# Altium schematic sheet Supplies.SchDoc
size 127 x 254 mm
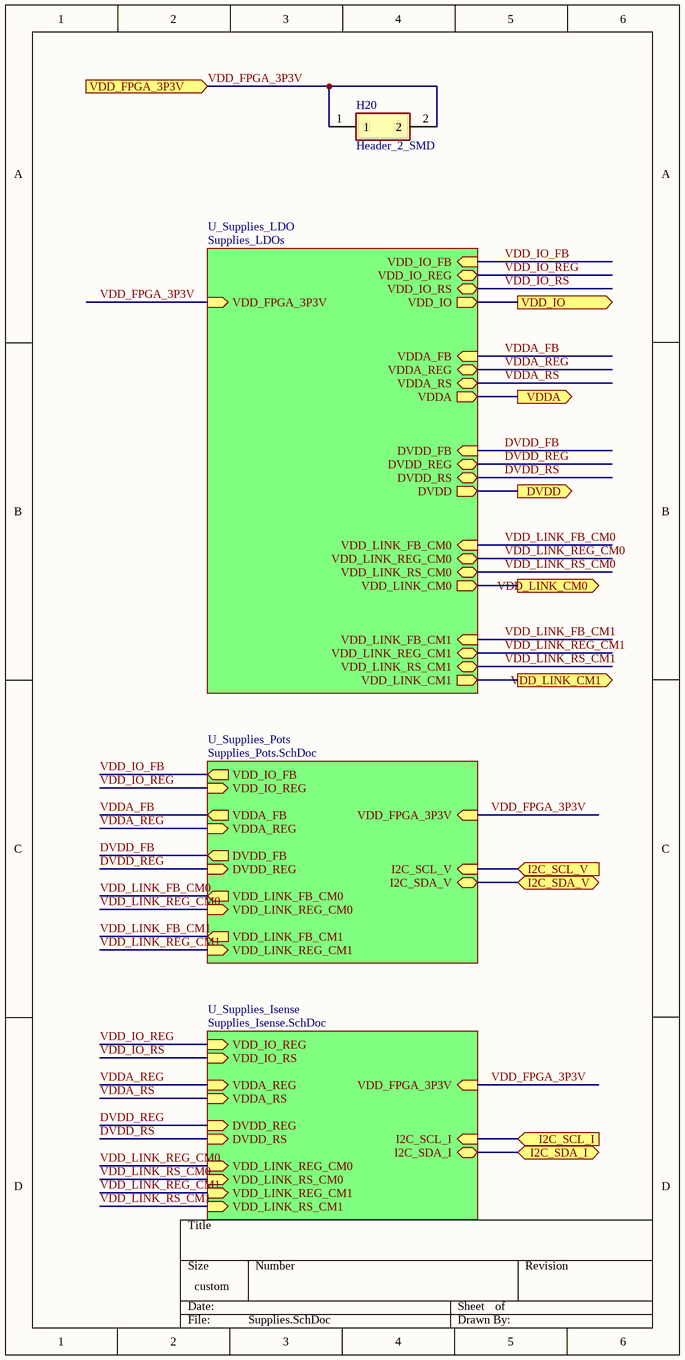
[diagram p0: Supplies.SchDoc]

## Parts
H20  Header_2_SMD  [HDR1X2_SMD_S]

## Sub-sheets
U_Supplies_Isense = Supplies_Isense.SchDoc: I2C_SDA_I (bidir), VDD_IO_REG (in), DVDD_REG (in), VDD_FPGA_3P3V (in), VDDA_RS (in), DVDD_RS (in), VDDA_REG (in), I2C_SCL_I (in), VDD_IO_RS (in), VDD_LINK_RS_CM1 (in), VDD_LINK_REG_CM1 (in), VDD_LINK_REG_CM0 (in), VDD_LINK_RS_CM0 (in)
U_Supplies_LDO = Supplies_LDOs: VDD_IO_FB (in), DVDD_FB (in), VDD_IO_RS (bidir), DVDD (out), VDDA_RS (bidir), VDDA (out), VDD_IO_REG (bidir), DVDD_RS (bidir), VDDA_FB (in), VDDA_REG (bidir), DVDD_REG (bidir), VDD_IO (out), VDD_FPGA_3P3V (in), VDD_LINK_RS_CM1 (bidir), VDD_LINK_FB_CM0 (in), VDD_LINK_CM1 (out), VDD_LINK_CM0 (out), VDD_LINK_REG_CM0 (bidir), VDD_LINK_REG_CM1 (bidir), VDD_LINK_FB_CM1 (in), VDD_LINK_RS_CM0 (bidir)
U_Supplies_Pots = Supplies_Pots.SchDoc: VDD_FPGA_3P3V (in), VDD_IO_REG (in), VDDA_FB (out), DVDD_REG (in), VDDA_REG (in), DVDD_FB (out), VDD_IO_FB (out), I2C_SCL_V (in), I2C_SDA_V (bidir), VDD_LINK_REG_CM1 (in), VDD_LINK_FB_CM0 (out), VDD_LINK_REG_CM0 (in), VDD_LINK_FB_CM1 (out)

## Ports
DVDD (out), I2C_SCL_I (in), I2C_SCL_V (in), I2C_SDA_I (bidir), I2C_SDA_V (bidir), VDD_FPGA_3P3V (in), VDD_IO (out), VDD_LINK_CM0 (out), VDD_LINK_CM1 (out), VDDA (out)

## Nets
DVDD: port DVDD, sheet U_Supplies_LDO/DVDD
DVDD_FB: sheet U_Supplies_LDO/DVDD_FB, sheet U_Supplies_Pots/DVDD_FB
DVDD_REG: sheet U_Supplies_LDO/DVDD_REG, sheet U_Supplies_Isense/DVDD_REG, sheet U_Supplies_Pots/DVDD_REG
DVDD_RS: sheet U_Supplies_LDO/DVDD_RS, sheet U_Supplies_Isense/DVDD_RS
I2C_SCL_I: port I2C_SCL_I, sheet U_Supplies_Isense/I2C_SCL_I
I2C_SCL_V: port I2C_SCL_V, sheet U_Supplies_Pots/I2C_SCL_V
I2C_SDA_I: port I2C_SDA_I, sheet U_Supplies_Isense/I2C_SDA_I
I2C_SDA_V: port I2C_SDA_V, sheet U_Supplies_Pots/I2C_SDA_V
VDD_FPGA_3P3V: H20.1 H20.2 ; port VDD_FPGA_3P3V, sheet U_Supplies_LDO/VDD_FPGA_3P3V, sheet U_Supplies_Isense/VDD_FPGA_3P3V, sheet U_Supplies_Pots/VDD_FPGA_3P3V
VDD_IO: port VDD_IO, sheet U_Supplies_LDO/VDD_IO
VDD_IO_FB: sheet U_Supplies_LDO/VDD_IO_FB, sheet U_Supplies_Pots/VDD_IO_FB
VDD_IO_REG: sheet U_Supplies_LDO/VDD_IO_REG, sheet U_Supplies_Isense/VDD_IO_REG, sheet U_Supplies_Pots/VDD_IO_REG
VDD_IO_RS: sheet U_Supplies_LDO/VDD_IO_RS, sheet U_Supplies_Isense/VDD_IO_RS
VDD_LINK_CM0: port VDD_LINK_CM0, sheet U_Supplies_LDO/VDD_LINK_CM0
VDD_LINK_CM1: port VDD_LINK_CM1, sheet U_Supplies_LDO/VDD_LINK_CM1
VDD_LINK_FB_CM0: sheet U_Supplies_LDO/VDD_LINK_FB_CM0, sheet U_Supplies_Pots/VDD_LINK_FB_CM0
VDD_LINK_FB_CM1: sheet U_Supplies_LDO/VDD_LINK_FB_CM1, sheet U_Supplies_Pots/VDD_LINK_FB_CM1
VDD_LINK_REG_CM0: sheet U_Supplies_LDO/VDD_LINK_REG_CM0, sheet U_Supplies_Isense/VDD_LINK_REG_CM0, sheet U_Supplies_Pots/VDD_LINK_REG_CM0
VDD_LINK_REG_CM1: sheet U_Supplies_LDO/VDD_LINK_REG_CM1, sheet U_Supplies_Isense/VDD_LINK_REG_CM1, sheet U_Supplies_Pots/VDD_LINK_REG_CM1
VDD_LINK_RS_CM0: sheet U_Supplies_LDO/VDD_LINK_RS_CM0, sheet U_Supplies_Isense/VDD_LINK_RS_CM0
VDD_LINK_RS_CM1: sheet U_Supplies_LDO/VDD_LINK_RS_CM1, sheet U_Supplies_Isense/VDD_LINK_RS_CM1
VDDA: port VDDA, sheet U_Supplies_LDO/VDDA
VDDA_FB: sheet U_Supplies_LDO/VDDA_FB, sheet U_Supplies_Pots/VDDA_FB
VDDA_REG: sheet U_Supplies_LDO/VDDA_REG, sheet U_Supplies_Isense/VDDA_REG, sheet U_Supplies_Pots/VDDA_REG
VDDA_RS: sheet U_Supplies_LDO/VDDA_RS, sheet U_Supplies_Isense/VDDA_RS

## Library data of the parts
H20 = Header_2_SMD: Connector Header Vertical, SMD, 2 position 0.100" (2.54mm); Manufacturer_Name: SAMTEC; Manufacturer_Part_Number: TSM-102-01-S-SV; Datasheet Link: https://componentsearchengine.com/Datasheets/2/TSM-102-01-S-SV.pdf; Arrow Part Number: TSM-102-01-S-SV; Arrow Price/Stock: https://www.arrow.com/en/products/tsm-102-01-s-sv/samtec; Mouser Part Number: 200-TSM10201SSV; Mouser Price/Stock: https://www.mouser.co.uk/ProductDetail/Samtec/TSM-102-01-S-SV?qs=FESYatJ8odJNSemiJZ%2Fyzw%3D%3D; Supplier 1: Digi-Key; Supplier Part Number 1: SAM10783-ND